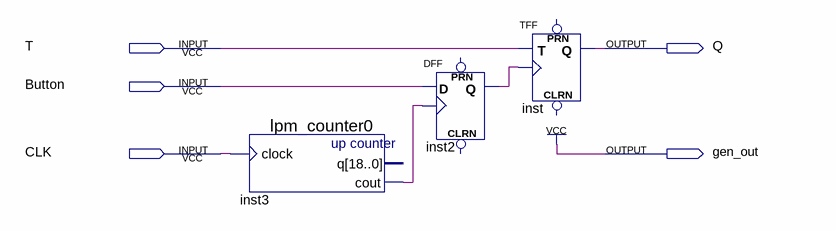
[diagram p0: schematic sheet]
// Quartus schematic scheme4.bdf as structural Verilog: 3 symbols, 5 pins
module scheme4 (
  input  T,
  input  Button,
  input  CLK,
  output Q,
  output gen_out
);

  wire inst2_q, inst3_cout;

  lpm_counter0 inst3 (.clock(CLK), .cout(inst3_cout));  // open: q
  DFF inst2 (.CLK(inst3_cout), .D(Button), .Q(inst2_q));  // open: CLRN, PRN
  TFF inst (.T(T), .CLK(inst2_q), .Q(Q));  // open: PRN, CLRN

  assign gen_out = 1'b1;
endmodule
